# Altium project Tray2.PrjPcb (part 2 of 2)

## Sheet Tray2_BCR_LT1513.SchDoc: BLUEsat Battery Charge Regulator
size A3; Engineer: Thomas Fisk; Organization: BLUEsat Project; Address1: Room 419; Address2: School of EE&T; Address3: UNSW, NSW 2052; Address4: Australia; DocumentNumber: POWR0001; Revision: 2; SheetNumber: 1; SheetTotal: 1; Description: SEPIC battery charge regulator with variable current control; Version: 4; PageSetup: Record=PageOptions|CenterHorizontal=True|CenterVertical=True|PrintScale=0.71|XCorrection=1.00|YCorrection=1.00|PrintKind=1|BorderSize=5000000|LeftOffset=0|BottomOffset=0|Orientation=2|PaperLength=1000|PaperWidth=1000|Scale=100|PaperSource=7|PrintQuality=1200|MediaType=1|DitherType=10|PaperKind=A4|PrintScaleMode=1
Used 5 times, as channels Designator/X+, Designator/Y+, Designator/Z+, Designator/X-, Designator/Y-. Parts and nets are listed once, with the designators drawn on the sheet.
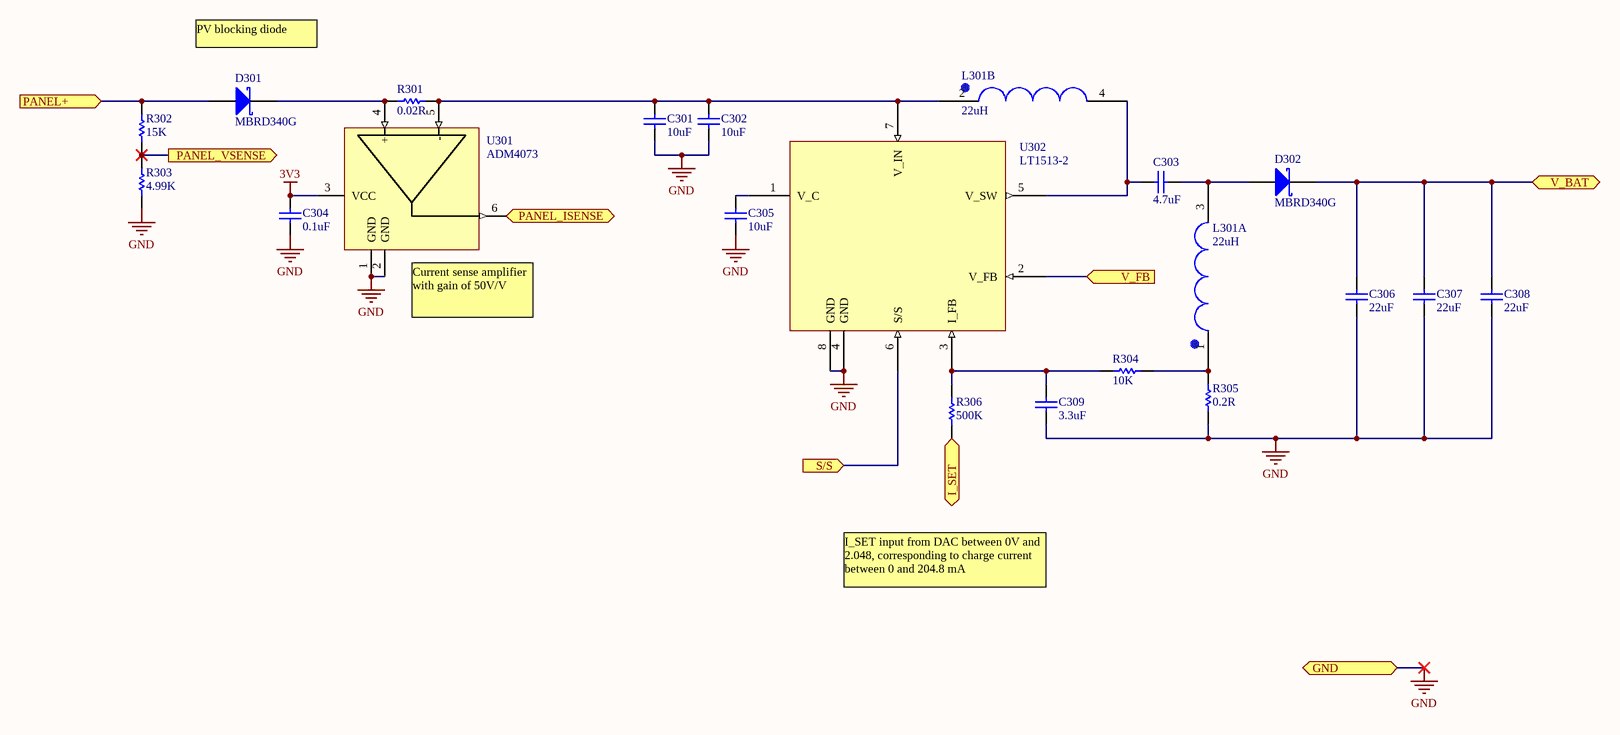
[diagram p6: Tray2_BCR_LT1513.SchDoc]

### Parts
C301  value 10uF  [CAPC3225M]  (hidden comment: Cap)
C302  value 10uF  [CAPC3225M]  (hidden comment: Cap)
C303  value 4.7uF  [CAPC3225M]  (hidden comment: Cap)
C304  value 0.1uF  [CAPC2012M]  (hidden comment: Cap)
C305  value 10uF  [CAPC3216M]  (hidden comment: Cap)
C306  value 22uF  [CAPC4532M]  (hidden comment: Cap)
C307  value 22uF  [CAPC4532M]  (hidden comment: Cap)
C308  value 22uF  [CAPC4532M]  (hidden comment: Cap)
C309  value 3.3uF  [CAPC3216M]  (hidden comment: Cap)
D301  MBRD340G  [TO229P990X238-3N]
D302  MBRD340G  [TO229P990X238-3N]
L301  value 22uH  [DRQ125]  (hidden comment: DRQ125 Dual Inductor)  (parts A,B of 2)
R301  value 0.02R  [RESC2012M]  (hidden comment: Res1)
R302  value 15K  [RESC2012M]  (hidden comment: Res1)
R303  value 4.99K  [RESC2012M]  (hidden comment: Res1)
R304  value 10K  [RESC2012M]  (hidden comment: Res1)
R305  value 0.2R  [RESC2012M]  (hidden comment: Res1)
R306  value 500K  [RESC2012M]  (hidden comment: Res1)
U301  ADM4073  [SOT26A-6N]
U302  LT1513-2  [LT1513-2_TO127P1420-8N]

### Ports
GND, I_SET (in), PANEL+ (in), PANEL_ISENSE (out), PANEL_VSENSE (out), S/S (in), V_BAT, V_FB (in)

### Nets
3V3: C304.1 U301.3(VCC)
GND: C301.2 C302.2 C304.2 C305.2 C306.2 C307.2 C308.2 C309.1 R303.1 R305.1 U301.1(GND) U301.2(GND) U302.4(GND) U302.8(GND) ; port GND
I_SET: R306.2 ; port I_SET
PANEL+: D301.1(A) R302.2 ; port PANEL+
PANEL_ISENSE: U301.6 ; port PANEL_ISENSE
PANEL_VSENSE: R302.1 R303.2 ; port PANEL_VSENSE
S/S: U302.6(S/S) ; port S/S
V_BAT: C306.1 C307.1 C308.1 D302.2(K) ; port V_BAT
V_FB: U302.2(V_FB) ; port V_FB
NetC301_1: C301.1 C302.1 L301.2 R301.1 U301.5(-) U302.7(V_IN)
NetC303_1: C303.1 D302.1(A) L301.3
NetC303_2: C303.2 L301.4 U302.5(V_SW)
NetC305_1: C305.1 U302.1(V_C)
NetC309_2: C309.2 R304.2 R306.1 U302.3(I_FB)
NetD301_2: D301.2(K) R301.2 U301.4(+)
NetL301_1: L301.1 R304.1 R305.2

### Channels
Designator/X+: designators end in .A; ports GND=GND I_SET=I_SET_X+ PANEL+=PANEL_X+ PANEL_ISENSE=ISENSE_X+ PANEL_VSENSE=VSENSE_X+ S/S=NetU302.A_6 V_BAT=NetC306.A_1 V_FB=V_FB
Designator/Y+: designators end in .B; ports GND=GND I_SET=I_SET_Y+ PANEL+=PANEL_Y+ PANEL_ISENSE=ISENSE_Y+ PANEL_VSENSE=VSENSE_Y+ S/S=NetU302.B_6 V_BAT=NetC306.A_1 V_FB=V_FB
Designator/Z+: designators end in .C; ports GND=GND I_SET=I_SET_Z+ PANEL+=PANEL_Z+ PANEL_ISENSE=ISENSE_Z+ PANEL_VSENSE=VSENSE_Z+ S/S=NetU302.C_6 V_BAT=NetC306.A_1 V_FB=V_FB
Designator/X-: designators end in .D; ports GND=GND I_SET=I_SET_X- PANEL+=PANEL_X- PANEL_ISENSE=ISENSE_X- PANEL_VSENSE=VSENSE_X- S/S=NetU302.D_6 V_BAT=NetC306.A_1 V_FB=V_FB
Designator/Y-: designators end in .E; ports GND=GND I_SET=I_SET_Y- PANEL+=PANEL_Y- PANEL_ISENSE=ISENSE_Y- PANEL_VSENSE=VSENSE_Y- S/S=NetU302.E_6 V_BAT=NetC306.A_1 V_FB=V_FB

### Notes on the sheet
- PV blocking diode
- (near U301) Current sense amplifier with gain of 50V/V
- I_SET input from DAC between 0V and 2.048, corresponding to charge current between 0 and 204.8 mA
- Title
- Description:
- Size:
- Author:
- Date:
- A3
- Time:
- Version
- Sheet:
- Drawing No.:
- of
- File:

### Library data of the parts
C301-C309 = Cap: Capacitor; Published: 8-Jun-2000; LatestRevisionDate: 17-Jul-2002; LatestRevisionNote: Re-released for DXP Platform.; PackageReference: RAD-0.3; Publisher: Altium Limited; PackageDescription: Radial Cap, Thru-Hole; 2 Leads; 0.3 in Pin Spacing; Supplier 1: Farnell; Supplier 2: Farnell
  C301 C302: Supplier Part Number 2: 1844365
  C303: Supplier Part Number 2: 1844381
  C304 C305: Supplier Part Number 2: 1759265
  C306-C308: Supplier Part Number 2: 1844378
  C309: Supplier Part Number 2: 1168132
D301 D302 = Diode 11DQ03: Schottky Rectifier; Published: 8-Jun-2000; LatestRevisionDate: 17-Jul-2002; LatestRevisionNote: Re-released for DXP Platform.; DatasheetVersion: Dec-1997; PackageReference: DO-204AL; Publisher: Altium Limited; PackageDescription: Diode, Axial; Body 5.2 x 2.7 mm (LxDia. max), Lead Dia. 0.86 mm (max); Code_JEDEC: DO-204-AL; ComponentLink1Description: Manufacturer Link; ComponentLink1URL: http://www.irf.com/; ComponentLink2Description: Datasheet; ComponentLink2URL: http://www.irf.com/product-info/datasheets/data/11dq03.pdf; Supplier 1: Farnell; Supplier Part Number 1: 1431096
R301-R306 = Res1: Resistor; Published: 8-Jun-2000; LatestRevisionDate: 17-Jul-2002; LatestRevisionNote: Re-released for DXP Platform.; PackageReference: AXIAL-0.3; Publisher: Altium Limited; PackageDescription: Axial Device, Thru-Hole; 2 Leads; 0.3 in Pin Spacing; Supplier 1: Farnell
U301 = ADM4073: Current Sense Amplifer

## Sheet Tray2_Comms.SchDoc
size A4
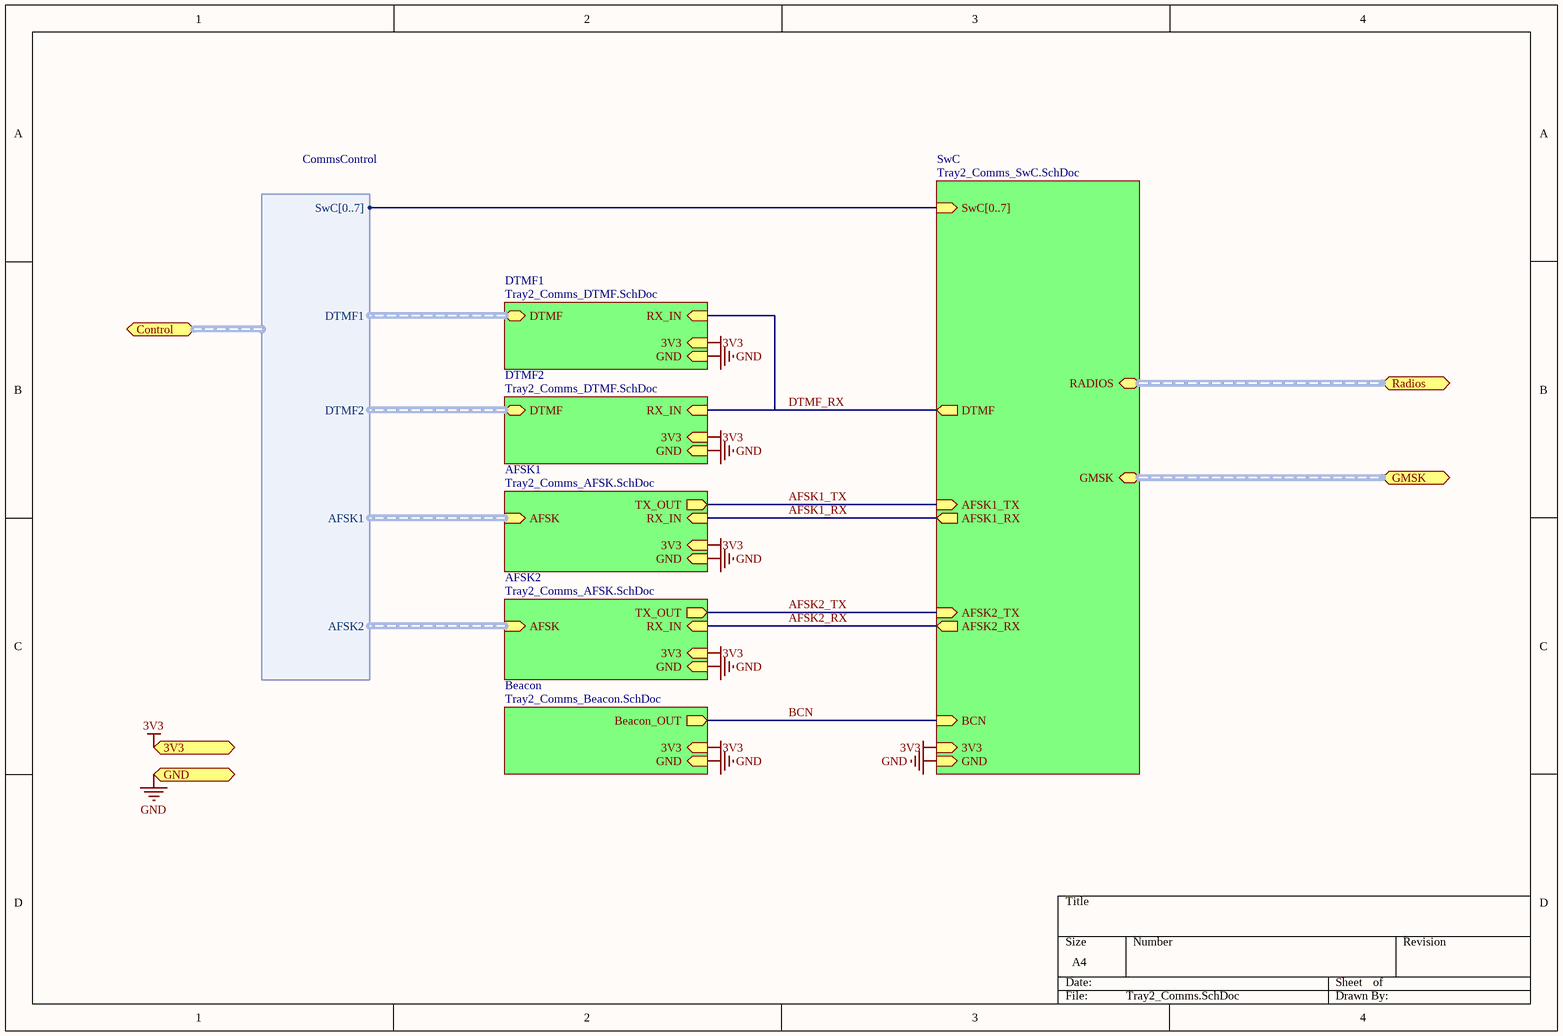
[diagram p7: Tray2_Comms.SchDoc]

### Sub-sheets
AFSK1 = Tray2_Comms_AFSK.SchDoc: RX_IN (in), AFSK (harness AFSK), TX_OUT (out), 3V3 (in), GND (in)
AFSK2 = Tray2_Comms_AFSK.SchDoc: RX_IN (in), AFSK (harness AFSK), TX_OUT (out), 3V3 (in), GND (in)
Beacon = Tray2_Comms_Beacon.SchDoc: Beacon_OUT (out), 3V3 (in), GND (in)
DTMF1 = Tray2_Comms_DTMF.SchDoc (file not in this document): RX_IN (in), DTMF (harness DTMF), 3V3 (in), GND (in)
DTMF2 = Tray2_Comms_DTMF.SchDoc (file not in this document): RX_IN (in), DTMF (harness DTMF), 3V3 (in), GND (in)
SwC = Tray2_Comms_SwC.SchDoc: BCN (in), AFSK1_TX (in), AFSK2_TX (in), AFSK1_RX (out), AFSK2_RX (out), DTMF (out), SwC[0..7] (in), RADIOS (harness Radios), GMSK (harness GMSK), 3V3 (in), GND (in)

### Ports
3V3 (in), Control (harness CommsControl), GMSK (harness GMSK), GND (in), Radios (harness Radios)

### Harnesses
CommsControl: DTMF1, DTMF2, AFSK1, AFSK2, SwC[0..7]

### Nets
3V3: port 3V3, sheet DTMF1/3V3, sheet DTMF2/3V3, sheet Beacon/3V3, sheet SwC/3V3, sheet AFSK1/3V3, sheet AFSK2/3V3
GND: port GND, sheet DTMF1/GND, sheet DTMF2/GND, sheet Beacon/GND, sheet SwC/GND, sheet AFSK1/GND, sheet AFSK2/GND
AFSK1_RX: sheet SwC/AFSK1_RX, sheet AFSK1/RX_IN
AFSK1_TX: sheet SwC/AFSK1_TX, sheet AFSK1/TX_OUT
AFSK2_RX: sheet SwC/AFSK2_RX, sheet AFSK2/RX_IN
AFSK2_TX: sheet SwC/AFSK2_TX, sheet AFSK2/TX_OUT
BCN: sheet Beacon/Beacon_OUT, sheet SwC/BCN
DTMF_RX: sheet DTMF1/RX_IN, sheet DTMF2/RX_IN, sheet SwC/DTMF

### Buses and harness runs
harness port GMSK = sheet SwC/GMSK
harness port Radios = sheet SwC/RADIOS

## Sheet Tray2_Comms_Beacon.SchDoc: BLUEsat Beacon
size A3; Author: Daniel Jedrychowski; Engineer: D. JEDRYCHOWSKI; Organization: BLUEsat Project; Address1: Room 419; Address2: School of EE&T; Address3: UNSW, NSW 2052; Address4: Australia; DocumentNumber: COMS0001; SheetNumber: 1; SheetTotal: 1; Description: Morse code continuous wave beacon based on EPROM; Version: 1.1
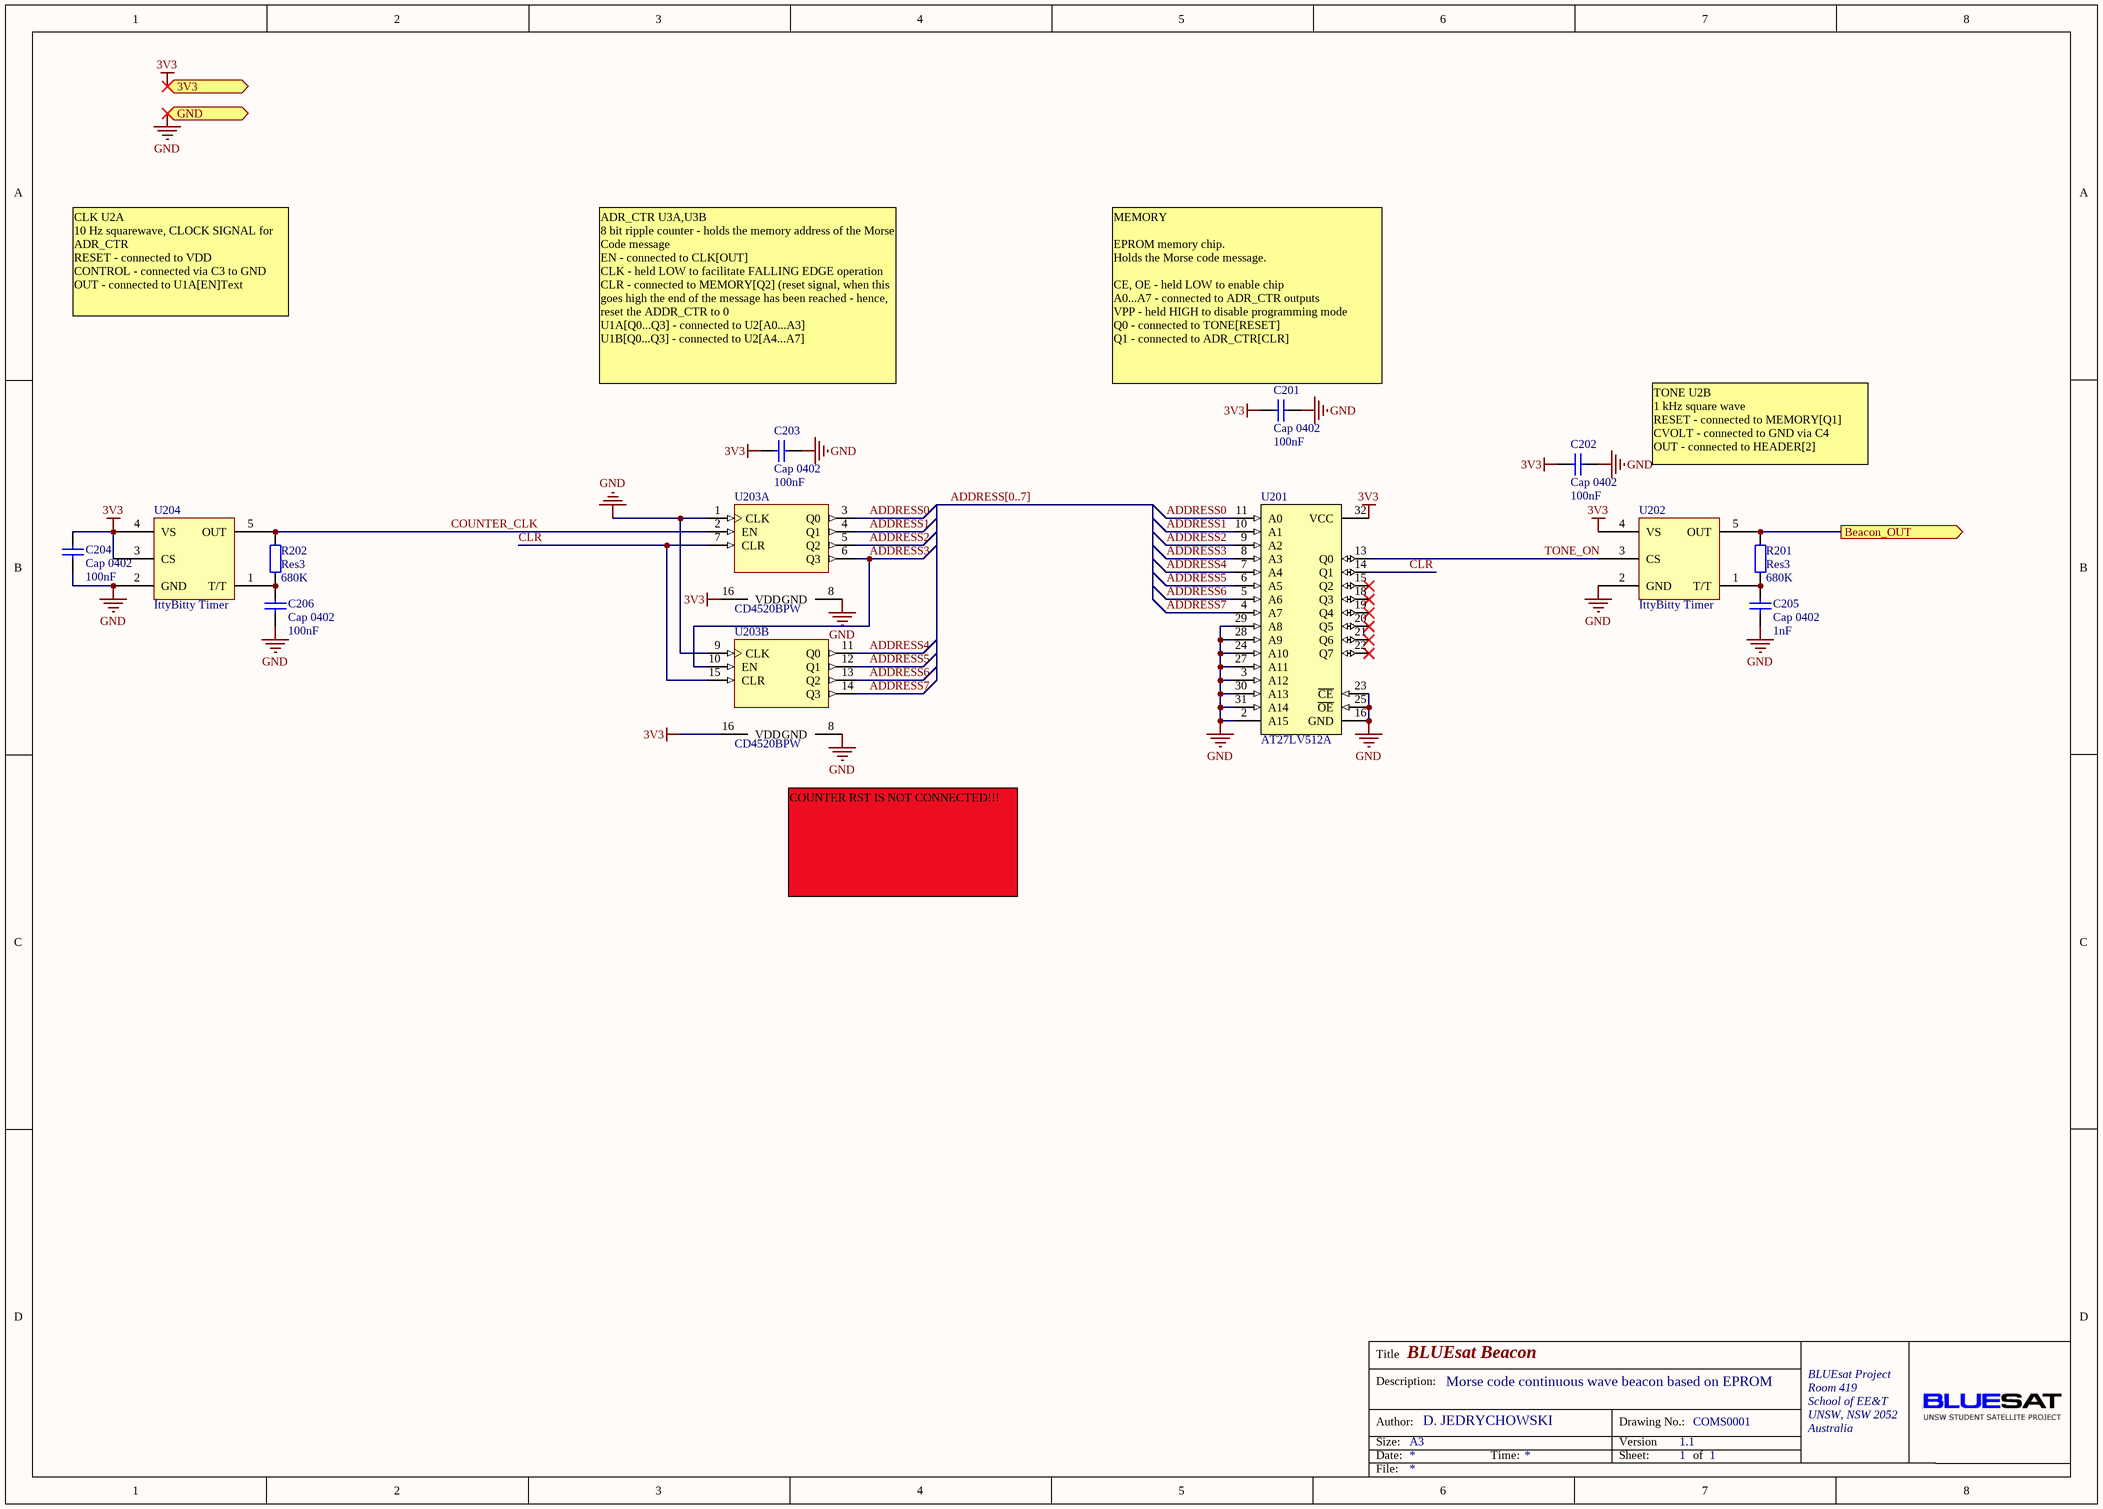
[diagram p8: Tray2_Comms_Beacon.SchDoc]

### Parts
C201  Cap 0402  value 100nF  [CAPC1005X06L]
C202  Cap 0402  value 100nF  [CAPC1005X06L]
C203  Cap 0402  value 100nF  [CAPC1005X06L]
C204  Cap 0402  value 100nF  [CAPC1005X06L]
C205  Cap 0402  value 1nF  [CAPC1005X06L]
C206  Cap 0402  value 100nF  [CAPC1005X06L]
R201  Res3  value 680K  [RESC1005X06L]
R202  Res3  value 680K  [RESC1005X06L]
U201  AT27LV512A  [PLCC7*9]
U202  IttyBitty Timer  [SOT23-5]
U203  CD4520BPW  [TSSOP16]  (parts A,B of 2)
U204  IttyBitty Timer  [SOT23-5]

### Ports
3V3 (in), Beacon_OUT (out), GND (in)

### Nets
3V3: C201.1 C202.1 C203.1 C204.2 U201.32(VCC) U202.4(VS) U203.16(VDD) U204.3(CS) U204.4(VS) ; port 3V3
GND: C201.2 C202.2 C203.2 C204.1 C205.1 C206.1 U201.2(A15) U201.3(A12) U201.16(GND) U201.23(~{CE}) U201.24(A10) U201.25(~{OE}) U201.27(A11) U201.28(A9) U201.29(A8) U201.30(A13) U201.31(A14) U202.2(GND) U203.1(CLK) U203.8(GND) U203.9(CLK) U204.2(GND) ; port GND
ADDRESS0: U201.11(A0) U203.3(Q0)
ADDRESS1: U201.10(A1) U203.4(Q1)
ADDRESS2: U201.9(A2) U203.5(Q2)
ADDRESS3: U201.8(A3) U203.6(Q3) U203.10(EN)
ADDRESS4: U201.7(A4) U203.11(Q0)
ADDRESS5: U201.6(A5) U203.12(Q1)
ADDRESS6: U201.5(A6) U203.13(Q2)
ADDRESS7: U201.4(A7) U203.14(Q3)
BCN: R201.1 U202.5(OUT) ; port Beacon_OUT
CLR: U201.14(Q1) U203.7(CLR) U203.15(CLR)
COUNTER_CLK: R202.1 U203.2(EN) U204.5(OUT)
TONE_ON: U201.13(Q0) U202.3(CS)
NetC205_2: C205.2 R201.2 U202.1(T/T)
NetC206_2: C206.2 R202.2 U204.1(T/T)

Not connected (* = marked no-connect by the designer): U201 15(Q2)* 18(Q3)* 19(Q4)* 20(Q5)* 21(Q6)* 22(Q7)*

### Buses and harness runs
bus ADDRESS[0..7]

### Notes on the sheet
- CLK U2A
  10 Hz squarewave, CLOCK SIGNAL for ADR_CTR
  RESET - connected to VDD
  CONTROL - connected via C3 to GND
  OUT - connected to U1A[EN]Text
- ADR_CTR U3A,U3B
  8 bit ripple counter - holds the memory address of the Morse Code message
  EN - connected to CLK[OUT]
  CLK - held LOW to facilitate FALLING EDGE operation
  CLR - connected to MEMORY[Q2] (reset signal, when this goes high the end of the message has been reached - hence, reset the ADDR_CTR to 0
  U1A[Q0...Q3] - connected to U2[A0...A3]
  U1B[Q0...Q3] - connected to U2[A4...A7]
- (near C201) MEMORY
  EPROM memory chip.
  Holds the Morse code message.
  CE, OE - held LOW to enable chip
  A0...A7 - connected to ADR_CTR outputs
  VPP - held HIGH to disable programming mode
  Q0 - connected to TONE[RESET]
  Q1 - connected to ADR_CTR[CLR]
- TONE U2B
  1 kHz square wave
  RESET - connected to MEMORY[Q1]
  CVOLT - connected to GND via C4
  OUT - connected to HEADER[2]
- COUNTER RST IS NOT CONNECTED!!!
- Title
- Description:
- Size:
- Author:
- Date:
- A3
- Time:
- Version
- Sheet:
- Drawing No.:
- of
- File:

### Library data of the parts
C201-C206 = Cap 0402: Capacitor; Published: 8-Jun-2000; LatestRevisionDate: 17-Jul-2002; LatestRevisionNote: Re-released for DXP Platform.; PackageReference: RAD-0.3; Publisher: Altium Limited; PackageDescription: Radial Cap, Thru-Hole; 2 Leads; 0.3 in Pin Spacing
R201 R202 = Res3: Resistor; Published: 8-Jun-2000; LatestRevisionDate: 29-May-2009; LatestRevisionNote: IPC-7351 Footprint Added.; PackageReference: J1-0603; Publisher: Altium Limited; PackageDescription: Chip Resistor
U201 = AT27LV512A: 512 Kbit (32Kb X 8) UV EPROM and OTP EPROM; Published: 24-Aug-2001; LatestRevisionDate: 06-Jun-2005; LatestRevisionNote: Stylized 3D Model Added.; DatasheetVersion: Jul-1998; PackageVersion: Jan-2003; PackageReference: PDIP28; Publisher: Altium Limited; PackageDescription: DIP; 28 Leads; Row Spacing 15.24 mm; Pitch 2.54 mm; ComponentLink1Description: Manufacturer Link; ComponentLink1URL: http://www.st.com/; ComponentLink2Description: Datasheet; ComponentLink2URL: http://www.st.com/stonline/products/literature/ds/2384/m27c256b.pdf; Supplier 1: Digi-Key; Supplier Part Number 1: AT27LV256A-70RC-ND
U202 U204 = MIC1557: Miniature Astable Timer Chip; Supplier: Farnell; Supplier Part Number: 1517241
U203 = CD4520BPW: Dual Binary Up-Counter; Supplier 1: Farnell; Supplier Part Number 1: 1752815

## Sheet Tray2_Comms_SwC.SchDoc: BLUEsat Switching Circuit Overview
size A3; Engineer: D. JEDRYCHOWSKI; Organization: BLUEsat Project; Address1: Room 419; Address2: School of EE&T; Address3: UNSW, NSW 2052; Address4: Australia; DocumentNumber: COMS0004; SheetNumber: 1; SheetTotal: 4; Description: Overview of Switching Circuit; Version: 1.0
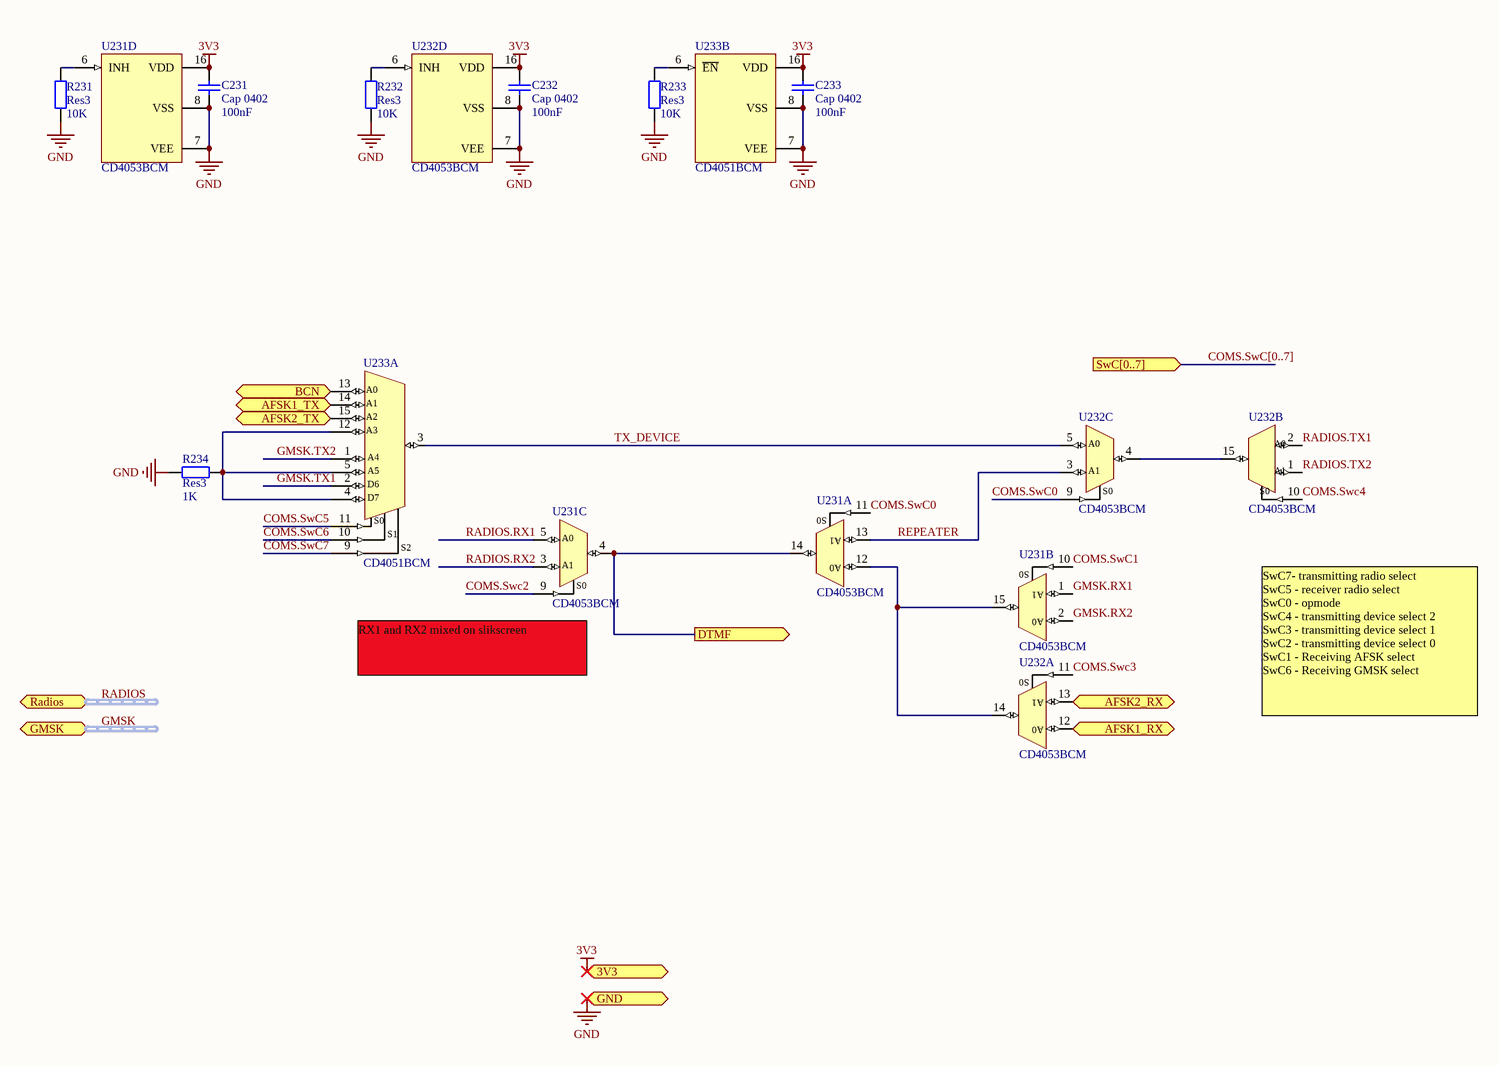
[diagram p9: Tray2_Comms_SwC.SchDoc]

### Parts
C231  Cap 0402  value 100nF  [CAPC1005X06L]
C232  Cap 0402  value 100nF  [CAPC1005X06L]
C233  Cap 0402  value 100nF  [CAPC1005X06L]
R231  Res3  value 10K  [RESC1005X06L]
R232  Res3  value 10K  [RESC1005X06L]
R233  Res3  value 10K  [RESC1005X06L]
R234  Res3  value 1K  [RESC1005X06L]
U231  CD4053BCM  [TSSOP16]  (parts A,B,C,D of 4)
U232  CD4053BCM  [TSSOP16]  (parts A,B,C,D of 4)
U233  CD4051BCM  [TSSOP16]  (parts A,B of 2)

### Ports
3V3 (in), AFSK1_RX (out), AFSK1_TX (in), AFSK2_RX (out), AFSK2_TX (in), BCN (in), DTMF (out), GMSK (harness GMSK), GND (in), Radios (harness RADIOS), SwC[0..7] (in)

### Nets
3V3: C231.2 C232.2 C233.2 U231.16(VDD) U232.16(VDD) U233.16(VDD) ; port 3V3
GND: C231.1 C232.1 C233.1 R231.2 R232.2 R233.2 R234.1 U231.7(VEE) U231.8(VSS) U232.7(VEE) U232.8(VSS) U233.7(VEE) U233.8(VSS) ; port GND
AFSK1_RX: U232.12(A0) ; port AFSK1_RX
AFSK1_TX: U233.14(A1) ; port AFSK1_TX
AFSK2_RX: U232.13(A1) ; port AFSK2_RX
AFSK2_TX: U233.15(A2) ; port AFSK2_TX
BCN: U233.13(A0) ; port BCN
COMS.SwC0: U231.11(A) U232.9(C)  [project net Control.SwC0]
COMS.SwC1: U231.10(B)  [project net Control.SwC1]
COMS.Swc2: U231.9(C)  [project net Control.SwC2]
COMS.Swc3: U232.11(A)  [project net Control.SwC3]
COMS.Swc4: U232.10(B)  [project net Control.SwC4]
COMS.SwC5: U233.11(S0)  [project net Control.SwC5]
COMS.SwC6: U233.10(S1)  [project net Control.SwC6]
COMS.SwC7: U233.9(S2)  [project net Control.SwC7]
DTMF_RX: U231.4(c_out) U231.14(A_out) ; port DTMF
GMSK.RX1: U231.1(by)
GMSK.RX2: U231.2(bx)
GMSK.TX1: U233.2(A6)
GMSK.TX2: U233.1(A4)
RADIOS.RX1: U231.5(cx)
RADIOS.RX2: U231.3(cy)
RADIOS.TX1: U232.2(bx)
RADIOS.TX2: U232.1(by)
REPEATER: U231.13(A1) U232.3(cy)
TX_DEVICE: U232.5(cx) U233.3(O)
NetR231_1: R231.1 U231.6(INH)
NetR232_1: R232.1 U232.6(INH)
NetR233_1: R233.1 U233.6(~{EN})
NetR234_2: R234.2 U233.4(A7) U233.5(A5) U233.12(A3)
NetU231_12: U231.12(A0) U231.15(b_out) U232.14(A_out)
NetU232_4: U232.4(c_out) U232.15(b_out)

### Buses and harness runs
bus COMS.SwC[0..7] = port SwC[0..7]
harness GMSK = port GMSK
harness RADIOS = port Radios

### Notes on the sheet
- (near U231) RX1 and RX2 mixed on slikscreen
- SwC7- transmitting radio select
  SwC5 - receiver radio select
  SwC0 - opmode
  SwC4 - transmitting device select 2
  SwC3 - transmitting device select 1
  SwC2 - transmitting device select 0
  SwC1 - Receiving AFSK select
  SwC6 - Receiving GMSK select
- Title
- Description:
- Size:
- Author:
- Date:
- A3
- Time:
- Version
- Sheet:
- Drawing No.:
- of
- File:
- (in symbol CD4051BCM, part A) D6; D7
- (in symbol CD4053BCM, part A) S0
- (in symbol CD4053BCM, part B) S0
- (in symbol CD4053BCM, part C) S0

### Library data of the parts
C231-C233 = Cap 0402: Capacitor; Published: 8-Jun-2000; LatestRevisionDate: 17-Jul-2002; LatestRevisionNote: Re-released for DXP Platform.; PackageReference: RAD-0.3; Publisher: Altium Limited; PackageDescription: Radial Cap, Thru-Hole; 2 Leads; 0.3 in Pin Spacing
R231-R234 = Res3: Resistor; Published: 8-Jun-2000; LatestRevisionDate: 29-May-2009; LatestRevisionNote: IPC-7351 Footprint Added.; PackageReference: J1-0603; Publisher: Altium Limited; PackageDescription: Chip Resistor
U231 U232 = CD4053BCM: Triple 2-Channnel Analog Multiplexer/Demutiplexer; Supplier 1: Farnell; Supplier Part Number 1: 2132284
U233 = CD4051BCM: 8-Channel Analog Multiplexer/Demultiplexer; Datasheet Link: http://focus.ti.com/lit/ds/symlink/cd4052b.pdf; Supplier 1: Farnell; Supplier Part Number 1: 1753421

## Sheet Tray2_Comms_AFSK.SchDoc: BLUEsat AFSK Modem
size A3; DrawnBy: Mitch Wenke, Chris Webb, Thomas Fisk; Engineer: C. WEBB, M. WENKE; Organization: BLUEsat Project; Address1: Room 419; Address2: School of EE&T; Address3: UNSW, NSW 2052; Address4: Australia; DocumentNumber: COMS0002; SheetNumber: 1; SheetTotal: 1; Description: AFSK modem based on CML MX614 IC; Version: 1.0
Used 2 times, as channels COMMS/AFSK1, COMMS/AFSK2. Parts and nets are listed once, with the designators drawn on the sheet.
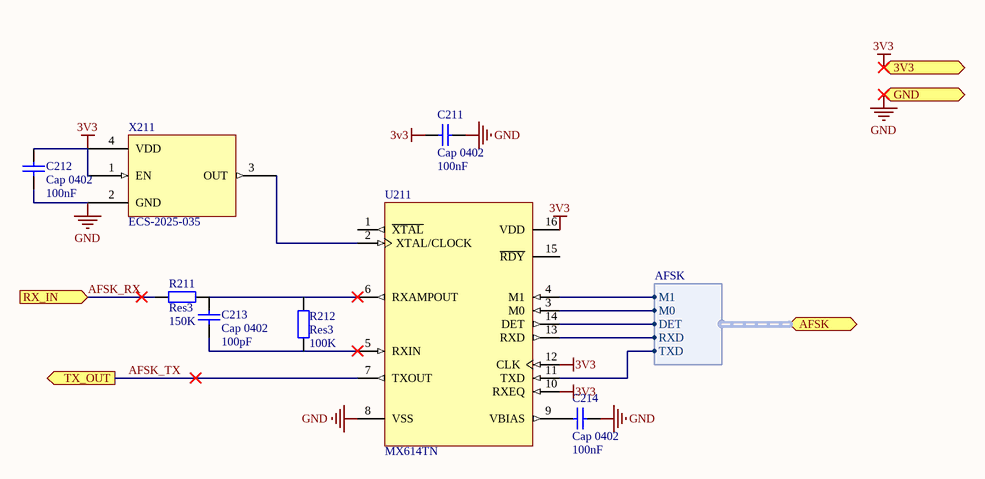
[diagram p10: Tray2_Comms_AFSK.SchDoc]

### Parts
C211  Cap 0402  value 100nF  [CAPC1005X06L]
C212  Cap 0402  value 100nF  [CAPC1005X06L]
C213  Cap 0402  value 100pF  [CAPC1005X06L]
C214  Cap 0402  value 100nF  [CAPC1005X06L]
R211  Res3  value 150K  [RESC1005X06L]
R212  Res3  value 100K  [RESC1005X06L]
U211  MX614TN  [SOIC16]
X211  ECS-2025-035  [ECS-2025]

### Ports
3V3 (in), AFSK (harness AFSK), GND (in), RX_IN (in), TX_OUT (out)

### Harnesses
AFSK: DET, M0, M1, RXD, TXD

### Nets
3V3: C211.2 C212.2 U211.10(RXEQ) U211.12(CLK) U211.16(VDD) X211.1(EN) X211.4(VDD) ; port 3V3
GND: C211.1 C212.1 C214.1 U211.8(VSS) X211.2(GND) ; port GND
AFSK_RX: R211.2 ; port RX_IN
AFSK_TX: U211.7(TXOUT) ; port TX_OUT
NetC213_1: C213.1 R212.2 U211.5(RXIN)
NetC213_2: C213.2 R211.1 R212.1 U211.6(RXAMPOUT)
NetC214_2: C214.2 U211.9(VBIAS)
NetU211_2: U211.2(XTAL/CLOCK) X211.3(OUT)
NetU211_3: U211.3(M0) ; port AFSK.M0
NetU211_4: U211.4(M1) ; port AFSK.M1
NetU211_11: U211.11(TXD) ; port AFSK.TXD
NetU211_13: U211.13(RXD) ; port AFSK.RXD
NetU211_14: U211.14(DET) ; port AFSK.DET

Not connected (* = marked no-connect by the designer): U211 1(~{XTAL}) 15(~{RDY})

### Channels
COMMS/AFSK1: designators end in .A; ports 3V3=3V3 GND=GND RX_IN=AFSK1_RX TX_OUT=AFSK1_TX
COMMS/AFSK2: designators end in .B; ports 3V3=3V3 GND=GND RX_IN=AFSK2_RX TX_OUT=AFSK2_TX

### Notes on the sheet
- Title
- Description:
- Size:
- Author:
- Date:
- A3
- Time:
- Version
- Sheet:
- Drawing No.:
- of
- File:

### Library data of the parts
C211-C214 = Cap 0402: Capacitor; Published: 8-Jun-2000; LatestRevisionDate: 17-Jul-2002; LatestRevisionNote: Re-released for DXP Platform.; PackageReference: RAD-0.3; Publisher: Altium Limited; PackageDescription: Radial Cap, Thru-Hole; 2 Leads; 0.3 in Pin Spacing
R211 R212 = Res3: Resistor; Published: 8-Jun-2000; LatestRevisionDate: 29-May-2009; LatestRevisionNote: IPC-7351 Footprint Added.; PackageReference: J1-0603; Publisher: Altium Limited; PackageDescription: Chip Resistor
U211 = MX614TN: Bell 202 Compatible Modem
X211 = ECS-2025-035: SMD Clock Oscillator, 3.579545MHz

## Nets that join several sheets
3V3: Tray2_Top (P4.1 R51.2), Tray2_ARM (40 pins), Tray2_Power (U11.2 U11.3 U11.6 U11.7), Regulation/3V3 (5 pins), Tray2_BCR (42 pins), Tray2_Comms_Beacon (9 pins), Tray2_Comms_SwC (6 pins), COMMS/AFSK1 (7 pins), COMMS/AFSK2 (7 pins)
5V0: Tray2_Power (U10.2 U10.3 U10.6 U10.7), Regulation/5V0 (5 pins)
9V1: Tray2_Power (R25.1 R26.1 U6.VCC U7.VCC), Regulation/9V1 (5 pins)
9V1_RX1: Tray2_Top (TR2_DB37.3), Tray2_Power (U7.OUT1)
9V1_RX2: Tray2_Top (TR2_DB37.22), Tray2_Power (U7.OUT2)
9V1_TX1: Tray2_Top (TR2_DB37.17), Tray2_Power (U6.OUT1)
9V1_TX2: Tray2_Top (TR2_DB37.36), Tray2_Power (U6.OUT2)
13V6: Tray2_Power (R20.1 U5.VCC), Regulation/13V6 (5 pins)
13V6_TX1: Tray2_Top (TR2_DB37.16), Tray2_Power (U5.OUT1)
GND: Tray2_Top (7 pins), Tray2_ARM (44 pins), Tray2_Power (31 pins), Regulation/13V6 (28 pins), Regulation/9V1 (28 pins), Regulation/5V0 (28 pins), Regulation/3V3 (28 pins), Regulation/VVAR (28 pins), Tray2_BCR (51 pins), Designator/X+ (14 pins), Designator/Y+ (14 pins), Designator/Z+ (14 pins), Designator/X- (14 pins), Designator/Y- (14 pins), Tray2_Comms_Beacon (22 pins), Tray2_Comms_SwC (13 pins), COMMS/AFSK1 (5 pins), COMMS/AFSK2 (5 pins)
VBATT: Regulation/13V6 (C13.D.1 FB1.D.2 FB2.D.2), Regulation/9V1 (C13.C.1 FB1.C.2 FB2.C.2), Regulation/5V0 (C13.B.1 FB1.B.2 FB2.B.2), Regulation/3V3 (C13.A.1 FB1.A.2 FB2.A.2), Regulation/VVAR (C13.E.1 FB1.E.2 FB2.E.2)
VVAR: Tray2_Power (R19.1 U4.VCC), Regulation/VVAR (5 pins)
VVAR_TX1: Tray2_Top (TR2_DB37.15), Tray2_Power (U4.OUT1)
VVAR_TX2: Tray2_Top (TR2_DB37.34), Tray2_Power (U4.OUT2)
3V3_FAULT1: Tray2_Power (U8.4), Regulation/3V3 (U2.A.21)
3V3_FAULT2: Tray2_Power (U8.5), Regulation/3V3 (U2.A.16)
3V3_PWRGD1: Tray2_Power (U8.3), Regulation/3V3 (U2.A.22)
3V3_PWRGD2: Tray2_Power (U8.6), Regulation/3V3 (U2.A.15)
5V0_EN1: Tray2_Power (U8.25), Regulation/5V0 (R6.B.2 R9.B.1 U1.B.3)
5V0_EN2: Tray2_Power (U8.26), Regulation/5V0 (R15.B.2 R18.B.1 U3.B.3)
5V0_FAULT1: Tray2_Power (U8.27), Regulation/5V0 (U2.B.21)
5V0_FAULT2: Tray2_Power (U8.1), Regulation/5V0 (U2.B.16)
5V0_PWRGD1: Tray2_Power (U8.28), Regulation/5V0 (U2.B.22)
5V0_PWRGD2: Tray2_Power (U8.2), Regulation/5V0 (U2.B.15)
9V1_EN1: Tray2_Power (U9.1), Regulation/9V1 (R6.C.2 R9.C.1 U1.C.3)
9V1_EN2: Tray2_Power (U9.2), Regulation/9V1 (R15.C.2 R18.C.1 U3.C.3)
9V1_FAULT1: Tray2_Power (U9.4), Regulation/9V1 (U2.C.21)
9V1_FAULT2: Tray2_Power (U9.5), Regulation/9V1 (U2.C.16)
9V1_PWRGD1: Tray2_Power (U9.3), Regulation/9V1 (U2.C.22)
9V1_PWRGD2: Tray2_Power (U9.6), Regulation/9V1 (U2.C.15)
13V6_EN1: Tray2_Power (U9.25), Regulation/13V6 (R6.D.2 R9.D.1 U1.D.3)
13V6_EN2: Tray2_Power (U9.26), Regulation/13V6 (R15.D.2 R18.D.1 U3.D.3)
13V6_FAULT1: Tray2_Power (U9.22), Regulation/13V6 (U2.D.21)
13V6_FAULT2: Tray2_Power (U9.23), Regulation/13V6 (U2.D.16)
13V6_PWRGD1: Tray2_Power (U9.21), Regulation/13V6 (U2.D.22)
13V6_PWRGD2: Tray2_Power (U9.24), Regulation/13V6 (U2.D.15)
AFSK1_RX: Tray2_Comms_SwC (U232.12), COMMS/AFSK1 (R211.A.2)
AFSK1_TX: Tray2_Comms_SwC (U233.14), COMMS/AFSK1 (U211.A.7)
AFSK2_RX: Tray2_Comms_SwC (U232.13), COMMS/AFSK2 (R211.B.2)
AFSK2_TX: Tray2_Comms_SwC (U233.15), COMMS/AFSK2 (U211.B.7)
BCN: Tray2_Comms_Beacon (R201.1 U202.5), Tray2_Comms_SwC (U233.13)
BCR.FTDI.RXI: Tray2_Top (P?.2), Tray2_BCR (U315.39)
BCR.FTDI.TXO: Tray2_Top (P?.3), Tray2_BCR (U315.38)
Control.SwC0: Tray2_ARM (U101.108), Tray2_Comms_SwC (U231.11 U232.9)
Control.SwC1: Tray2_ARM (U101.106), Tray2_Comms_SwC (U231.10)
Control.SwC2: Tray2_ARM (U101.102), Tray2_Comms_SwC (U231.9)
Control.SwC3: Tray2_ARM (U101.99), Tray2_Comms_SwC (U232.11)
Control.SwC4: Tray2_ARM (U101.95), Tray2_Comms_SwC (U232.10)
Control.SwC5: Tray2_ARM (U101.82), Tray2_Comms_SwC (U233.11)
Control.SwC6: Tray2_ARM (U101.81), Tray2_Comms_SwC (U233.10)
Control.SwC7: Tray2_ARM (U101.80), Tray2_Comms_SwC (U233.9)
I_SET_X+: Tray2_BCR (U314.2), Designator/X+ (R306.A.2)
I_SET_X-: Tray2_BCR (U314.13), Designator/X- (R306.D.2)
I_SET_Y+: Tray2_BCR (U314.3), Designator/Y+ (R306.B.2)
I_SET_Y-: Tray2_BCR (U314.14), Designator/Y- (R306.E.2)
I_SET_Z+: Tray2_BCR (U314.4), Designator/Z+ (R306.C.2)
ISENSE_X+: Tray2_BCR (U14.3 U315.63), Designator/X+ (U301.A.6)
ISENSE_X-: Tray2_BCR (U15.12 U315.5), Designator/X- (U301.D.6)
ISENSE_Y+: Tray2_BCR (U14.12 U315.1), Designator/Y+ (U301.B.6)
ISENSE_Y-: Tray2_BCR (U16.3 U315.7), Designator/Y- (U301.E.6)
ISENSE_Z+: Tray2_BCR (U15.3 U315.3), Designator/Z+ (U301.C.6)
JTAG.TCK: Tray2_Top (P4.4), Tray2_ARM (R104.1 U101.10)
JTAG.TMS: Tray2_Top (P4.2), Tray2_ARM (U101.6)
NetC306.A_1: Tray2_BCR (R313.2 R315.1 U316.4), Designator/X+ (C306.A.1 C307.A.1 C308.A.1 D302.A.2), Designator/Y+ (C306.B.1 C307.B.1 C308.B.1 D302.B.2), Designator/Z+ (C306.C.1 C307.C.1 C308.C.1 D302.C.2), Designator/X- (C306.D.1 C307.D.1 C308.D.1 D302.D.2), Designator/Y- (C306.E.1 C307.E.1 C308.E.1 D302.E.2)
NetP4_6: Tray2_Top (P4.6), Tray2_ARM (U101.2)
NetP4_7: Tray2_Top (P4.7), Tray2_ARM (R103.1 U101.206)
NetP4_8: Tray2_Top (P4.8), Tray2_ARM (U101.4)
NetR51_1: Tray2_Top (R51.1), Tray2_ARM (U101.8)
NetU101_116: Tray2_ARM (U101.116), COMMS/AFSK1 (U211.A.4)
NetU101_118: Tray2_ARM (U101.118), COMMS/AFSK1 (U211.A.3)
NetU101_120: Tray2_ARM (U101.120), COMMS/AFSK1 (U211.A.14)
NetU101_122: Tray2_ARM (U101.122), COMMS/AFSK2 (U211.B.4)
NetU101_124: Tray2_ARM (U101.124), COMMS/AFSK2 (U211.B.3)
NetU101_126: Tray2_ARM (U101.126), COMMS/AFSK2 (U211.B.14)
NetU101_128: Tray2_ARM (U101.128), COMMS/AFSK2 (U211.B.11)
NetU101_130: Tray2_ARM (U101.130), COMMS/AFSK2 (U211.B.13)
NetU302.A_6: Tray2_BCR (U312.1), Designator/X+ (U302.A.6)
NetU302.B_6: Tray2_BCR (U312.4), Designator/Y+ (U302.B.6)
NetU302.C_6: Tray2_BCR (U312.10), Designator/Z+ (U302.C.6)
NetU302.D_6: Tray2_BCR (U317.1), Designator/X- (U302.D.6)
NetU302.E_6: Tray2_BCR (U317.4), Designator/Y- (U302.E.6)
SCL: Tray2_ARM (U101.48), Tray2_Power (U8.12 U9.12 U12.12), Tray2_BCR (R320.2 U315.17)
SDA: Tray2_ARM (U101.50), Tray2_Power (U8.13 U9.13 U12.13), Tray2_BCR (R319.2 U315.16)
V_FB: Tray2_BCR (R313.1 R314.2), Designator/X+ (U302.A.2), Designator/Y+ (U302.B.2), Designator/Z+ (U302.C.2), Designator/X- (U302.D.2), Designator/Y- (U302.E.2)
VSENSE_X+: Tray2_BCR (U14.5 U315.64), Designator/X+ (R302.A.1 R303.A.2)
VSENSE_X-: Tray2_BCR (U15.10 U315.6), Designator/X- (R302.D.1 R303.D.2)
VSENSE_Y+: Tray2_BCR (U14.10 U315.2), Designator/Y+ (R302.B.1 R303.B.2)
VSENSE_Y-: Tray2_BCR (U16.5 U315.8), Designator/Y- (R302.E.1 R303.E.2)
VSENSE_Z+: Tray2_BCR (U15.5 U315.4), Designator/Z+ (R302.C.1 R303.C.2)
VVAR_EN1: Tray2_Power (U12.27), Regulation/VVAR (R6.E.2 R9.E.1 U1.E.3)
VVAR_EN2: Tray2_Power (U12.28), Regulation/VVAR (R15.E.2 R18.E.1 U3.E.3)
VVAR_FAULT1: Tray2_Power (U12.22), Regulation/VVAR (U2.E.21)
VVAR_FAULT2: Tray2_Power (U12.23), Regulation/VVAR (U2.E.16)
VVAR_FB1: Tray2_Power (R35.2 R36.2 R37.2 R38.2), Regulation/VVAR (5 pins)
VVAR_FB2: Tray2_Power (R39.2 R40.2 R41.2 R42.2), Regulation/VVAR (5 pins)
VVAR_PWRGD1: Tray2_Power (U12.21), Regulation/VVAR (U2.E.22)
VVAR_PWRGD2: Tray2_Power (U12.24), Regulation/VVAR (U2.E.15)